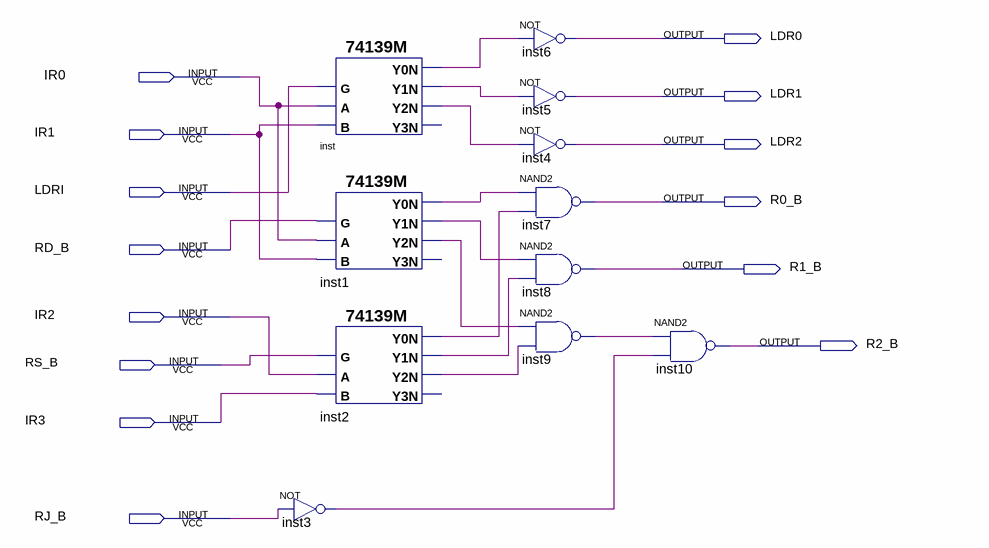
[diagram p0: schematic sheet]
// Quartus schematic LDR0_2.bdf as structural Verilog: 11 symbols, 14 pins
module LDR0_2 (
  input  IR0,
  input  IR1,
  input  LDRI,
  input  RD_B,
  input  IR2,
  input  RS_B,
  input  IR3,
  input  RJ_B,
  output LDR0,
  output LDR1,
  output LDR2,
  output R0_B,
  output R1_B,
  output R2_B
);

  wire inst1_y0n, inst1_y1n, inst1_y2n, inst2_y0n, inst2_y1n, inst2_y2n, inst3_out, inst9_out, inst_y0n,
       inst_y1n, inst_y2n;

  \74139M  inst (.B(IR1), .A(IR0), .G(LDRI), .Y2N(inst_y2n), .Y0N(inst_y0n), .Y1N(inst_y1n));  // open: Y3N
  \74139M  inst1 (.B(IR1), .A(IR0), .G(RD_B), .Y2N(inst1_y2n), .Y0N(inst1_y0n), .Y1N(inst1_y1n));  // open: Y3N
  \74139M  inst2 (.B(IR3), .A(IR2), .G(RS_B), .Y2N(inst2_y2n), .Y0N(inst2_y0n), .Y1N(inst2_y1n));  // open: Y3N
  not inst3 (inst3_out, RJ_B);
  not inst6 (LDR0, inst_y0n);
  not inst5 (LDR1, inst_y1n);
  not inst4 (LDR2, inst_y2n);
  nand inst7 (R0_B, inst1_y0n, inst2_y0n);
  nand inst8 (R1_B, inst1_y1n, inst2_y1n);
  nand inst9 (inst9_out, inst1_y2n, inst2_y2n);
  nand inst10 (R2_B, inst9_out, inst3_out);
endmodule
